# EAGLE design 16x2_lcd_Arduino_Shield (EAGLE 9.6.2)
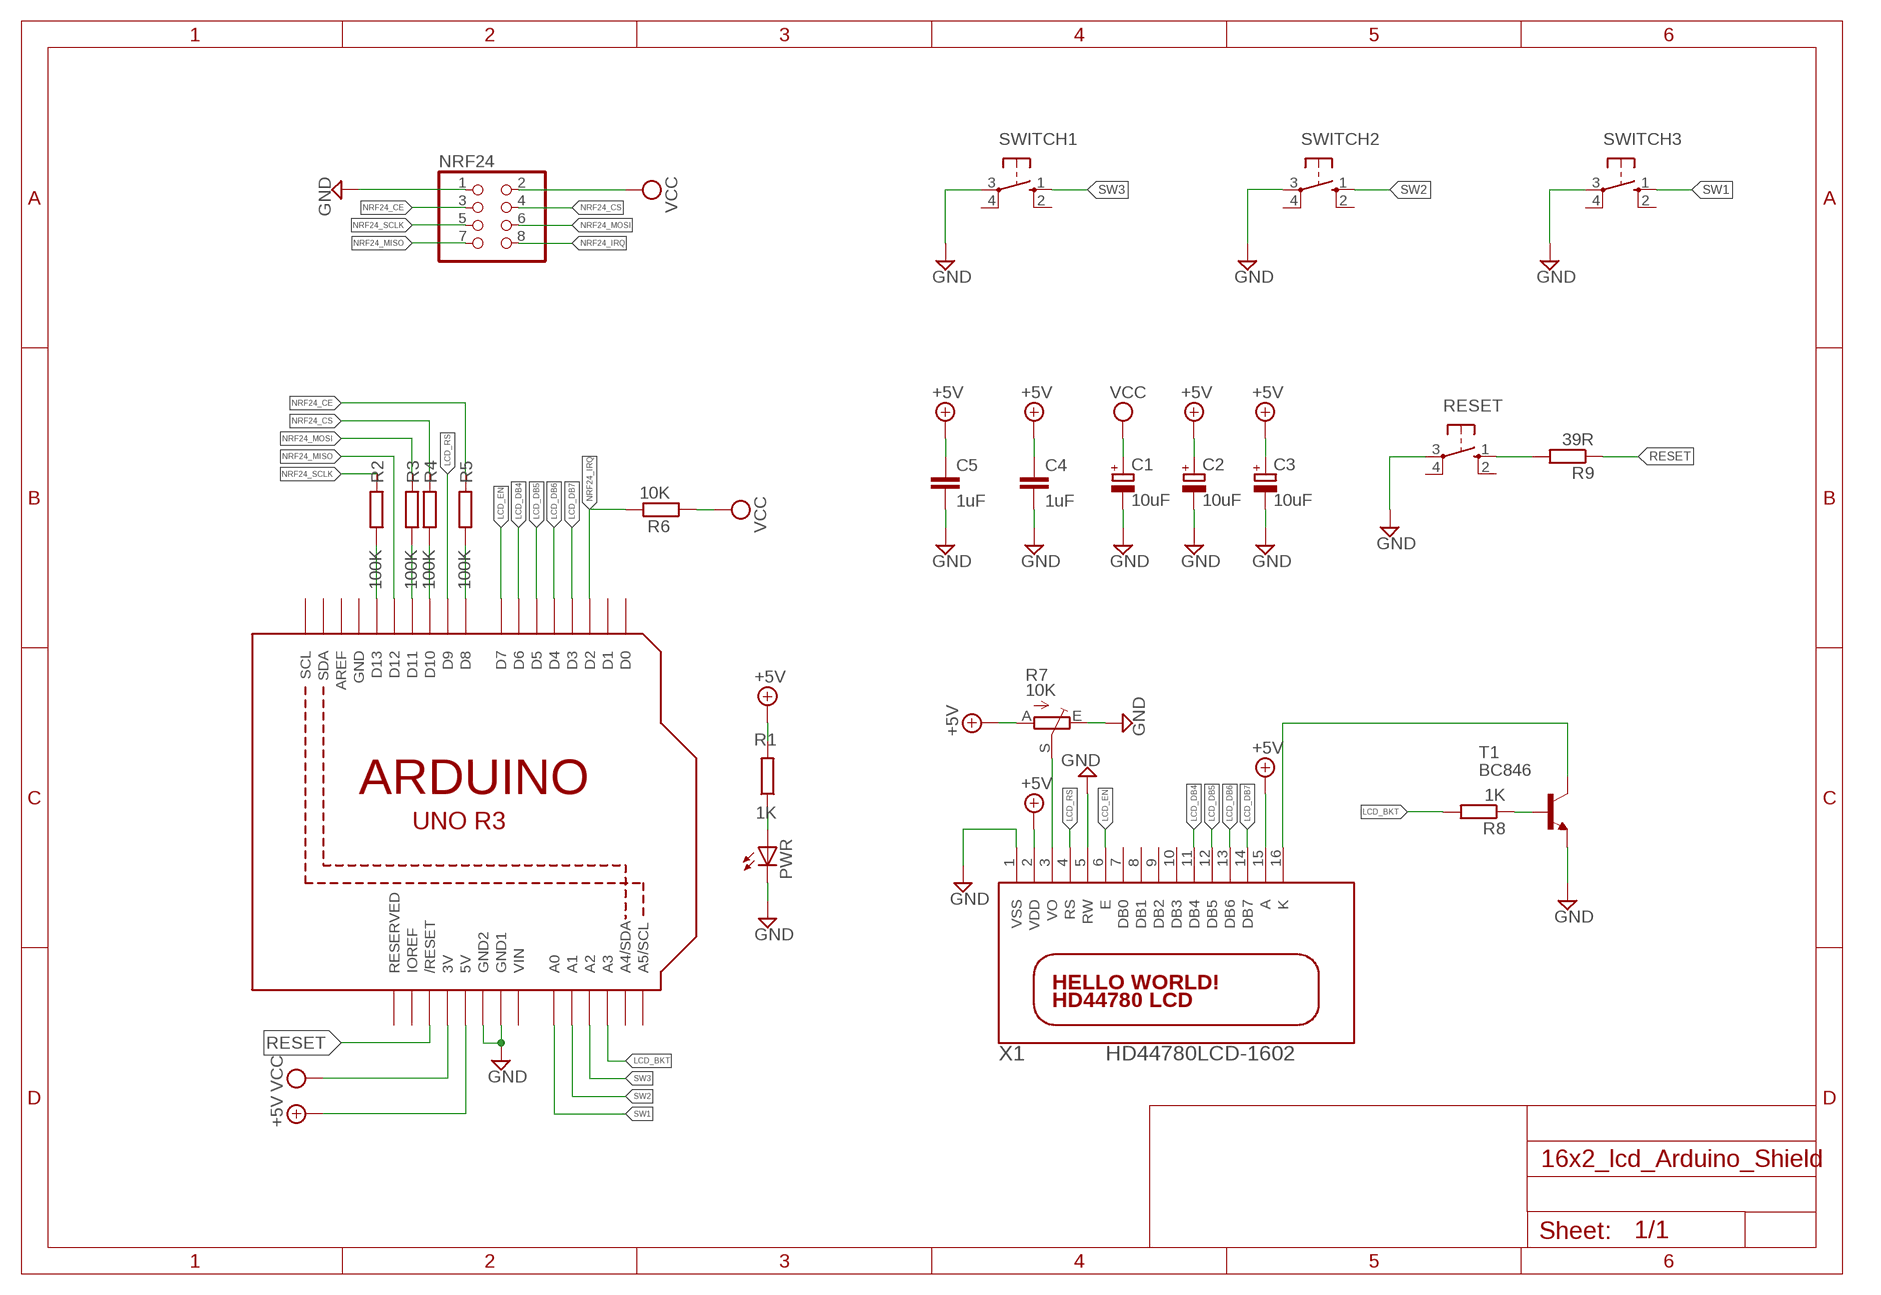
[diagram p0: schematic, sheet 1]

## Parts
C1  10uF  CPOL-EUCT3216  [CT3216]
C2  10uF  CPOL-EUCT3216  [CT3216]
C3  10uF  CPOL-EUCT3216  [CT3216]
C4  1uF  C-EUC1206  [C1206]
C5  1uF  C-EUC1206  [C1206]
NRF24  PINHD-2X4  [2X04]
PWR  LED5MM  [LED5MM]
R1  1K  R-EU_R1206  [R1206]
R2  100K  R-EU_R1206  [R1206]
R3  100K  R-EU_R1206  [R1206]
R4  100K  R-EU_R1206  [R1206]
R5  100K  R-EU_R1206  [R1206]
R6  10K  R-EU_R1206  [R1206]
R7  10K  TRIM_EU-RJ9W  [RJ9W]
R8  1K  R-EU_R1206  [R1206]
R9  39R  R-EU_R1206  [R1206]
RESET  10-XX  [B3F-10XX]
SWITCH1  10-XX  [B3F-10XX]
SWITCH2  10-XX  [B3F-10XX]
SWITCH3  10-XX  [B3F-10XX]
T1  BC846  [SOT23]
U1  ARDUINOR3-BPLACE  [ARDUINOR3-BPLACE]
X1  HD44780LCD-1602  [LCD1602]

## Nets
+5V [POWER]: C2.+ C3.+ C4.1 C5.1 R1.2 R7.A U1.5V X1.2(VDD) X1.15(A)
GND [POWER]: C1.- C2.- C3.- C4.2 C5.2 NRF24.1 PWR.K(C) R7.E RESET.3(P) SWITCH1.3(P) SWITCH2.3(P) SWITCH3.3(P) T1.2(E) U1.GND1 U1.GND2 X1.1(VSS) X1.5(RW)
LCD_BKT [LCD]: R8.2 U1.A3
LCD_DB4 [LCD]: U1.D6 X1.11(DB4)
LCD_DB5 [LCD]: U1.D5 X1.12(DB5)
LCD_DB6 [LCD]: U1.D4 X1.13(DB6)
LCD_DB7 [LCD]: U1.D3 X1.14(DB7)
LCD_EN [LCD]: U1.D7 X1.6(E)
LCD_RS [LCD]: U1.D9 X1.4(RS)
N$1: PWR.A R1.1
N$2: R2.1 U1.D13
N$3: R7.S X1.3(VO)
N$4: R3.1 U1.D11
N$5: R4.1 U1.D10
N$6: T1.3(C) X1.16(K)
N$7: R5.1 U1.D8
N$8: R8.1 T1.1(B)
N$9: R9.2 RESET.1(S)
NRF24_CE [NRF]: NRF24.3 R5.2
NRF24_CS [NRF]: NRF24.4 R4.2
NRF24_IRQ [NRF]: NRF24.8 R6.2 U1.D2
NRF24_MISO [NRF]: NRF24.7 U1.D12
NRF24_MOSI [NRF]: NRF24.6 R3.2
NRF24_SCLK [NRF]: NRF24.5 R2.2
RESET: R9.1 U1.RESET(/RESET)
SW1: SWITCH3.1(S) U1.A0
SW2: SWITCH2.1(S) U1.A1
SW3: SWITCH1.1(S) U1.A2
VCC [POWER]: C1.+ NRF24.2 R6.1 U1.3V
Unconnected: RESET.2(S1) RESET.4(P1) SWITCH1.2(S1) SWITCH1.4(P1) SWITCH2.2(S1) SWITCH2.4(P1) SWITCH3.2(S1) SWITCH3.4(P1) U1.A4(A4/SDA) U1.A5(A5/SCL) U1.AREF U1.D0 U1.D1 U1.IOREF U1.RESERVED U1.SCL U1.SDA X1.7(DB0) X1.8(DB1) X1.9(DB2) X1.10(DB3)

## Power pins joined to a net without a drawn wire
GND: U1.GND
VIN: U1.VIN

## Library data of the parts
C1-C3 = rcl:CPOL-EU: POLARIZED CAPACITOR, European symbol; SPICEPREFIX: C
C4 C5 = rcl:C-EU: CAPACITOR, European symbol; SPICEPREFIX: C
NRF24 = pinhead:PINHD-2X4: PIN HEADER
PWR = adafruit:LED: LED OSRAM: - CHIPLED LG R971, LG N971, LY N971, LG Q971, LY Q971, LO R971, LY R971 LH N974, LH R974 LS Q976, LO Q976, LY Q976 LO Q996 - Hyper CHIPLED LW Q18S LB Q993, LB Q99A, LB R99A - SideLED LS A670, LO A670, LY A670, LG A670, LP A670 LB A673, LV A673, LT A673, LW A673 LH A674 LY A675 LS A676, LA A676, LO A676, LY A676, LW A676 LS A679, LY A679, LG A679 - Hyper Micro SIDELED® LS Y876, LA Y876, LO Y876, LY Y876 LT Y87S - SmartLED LW L88C, LW L88S LB L89C, LB L89S, LG L890 LS L89K, LO L89K, LY L89K LS L896, LA L896, LO L896, LY L896 - TOPLED LS T670, LO T670, LY T670, LG T670, LP T670 LSG T670, LSP T670, LSY T670, LOP T670, LYG T670 LG T671, LOG T671, LSG T671 LB T673, LV T673, LT T673, LW T673 LH T674 LS T676, LA T676, LO T676, LY T676, LB T676, LH T676, LSB T676, LW T676 LB T67C, LV T67C, LT T67C, LS T67K, LO T67K, LY T67K, LW E67C LS E67B, LA E67B, LO E67B, LY E67B, LB E67C, LV E67C, LT E67C LW T67C LS T679, LY T679, LG T679 LS T770, LO T770, LY T770, LG T770, LP T770 LB T773, LV T773, LT T773, LW T773 LH T774 LS E675, LA E675, LY E675, LS T675 LS T776, LA T776, LO T776, LY T776, LB T776 LHGB T686 LT T68C, LB T68C - Hyper Mini TOPLED® LB M676 - Mini TOPLED Santana® LG M470 LS M47K, LO M47K, LY M47K Source: http://www.osram.convergy.de/
R1-R6 R8 R9 = rcl:R-EU_: RESISTOR, European symbol; SPICEPREFIX: R
R7 = pot:TRIM_EU-: POTENTIOMETER
RESET SWITCH1-SWITCH3 = switch-omron:10-XX: OMRON SWITCH; MPN: B3F-1000; OC_FARNELL: 176432; OC_NEWARK: 36M3542
T1 = transistor-neu-to92:BC846: NPN TRANSISTOR
U1 = adafruit:ARDUINOR3: This is a new object for the new Arduino R3 - with extra pins that you may want to use (such as IOref, and duplicated A4/A5
X1 = adafruit:HD44780LCD: HD44780 LCD Standard character type LCDs, available in sizes from 8x1 to 40x4!

## Net classes
0 default: width 0.254 mm, drill 0.406 mm, clearance 0.254 mm
1 POWER: width 0.406 mm, drill 0.406 mm, clearance 0.305 mm
2 NRF: width 0.203 mm, drill 0.406 mm, clearance 0.254 mm
3 LCD: width 0.254 mm, drill 0.406 mm, clearance 0.254 mm

## Board
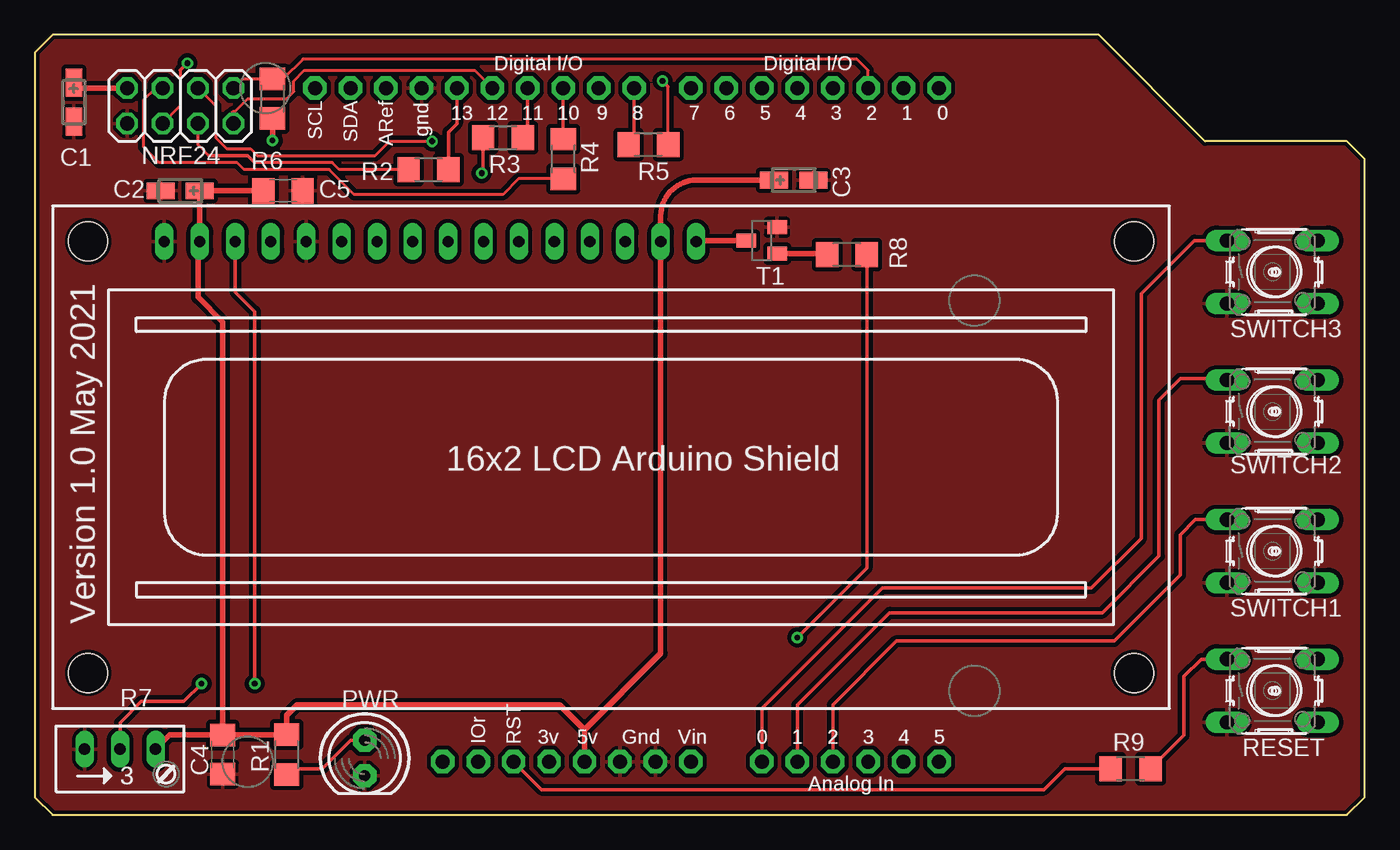
[diagram p1: board, top side]
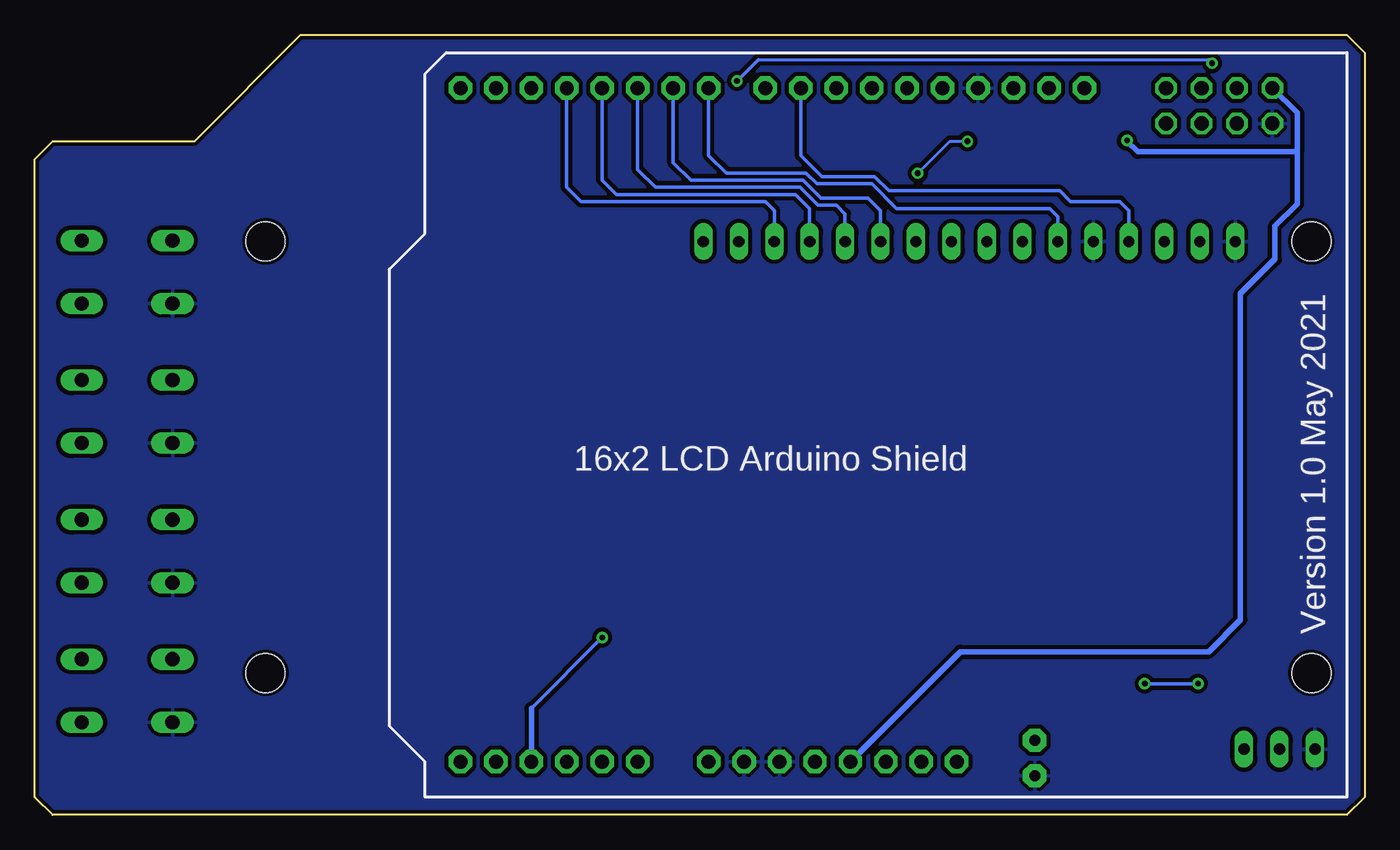
[diagram p2: board, bottom side, seen from below]

Size 95.25 x 55.88 mm. Coordinates in mm from the lower left corner, seen from the top.
Outline: 0,54.61 0,1.27 1.27,0 93.98,0 95.25,1.27 95.25,46.99 93.98,48.26 83.82,48.26 76.2,55.88 1.27,55.88 0,54.61
Copper layers (1*16): Top 0.035mm / dielectric 1.5mm / Bottom 0.035mm
Design rules "default *": minimum track width 6mil, minimum drill 0.35mm, track to track 8mil, track to pad 8mil, pad to pad 8mil, via to via 8mil, smd to smd 8mil, copper to edge 8mil, drill to drill 6mil, minimum pad ring 10mil, minimum via ring 8mil, stop-mask expansion 4mil, vias tented up to drill 0mil, thermal gap 10mil

### Footprints (pad centres in the part's own frame; a part is rotated, then mirrored left to right if it is on the bottom)
CT3216 = smd 2 x 1.2: + -1.4,0; - 1.4,0
C1206 = smd 1.6 x 1.8: 1 -1.4,0; 2 1.4,0
2X04 = drill 1.016 octagon: 1 -3.81,-1.27; 2 -3.81,1.27; 3 -1.27,-1.27; 4 -1.27,1.27; 5 1.27,-1.27; 6 1.27,1.27; 7 3.81,-1.27; 8 3.81,1.27
LED5MM = drill 0.813 pad 1.676 octagon: A -1.27,0; K 1.27,0
R1206 = smd 1.6 x 1.803: 1 -1.422,0; 2 1.422,0
RJ9W = drill 0.813 long: A 2.54,0.635; E -2.54,0.635; S 0,0.635
B3F-10XX = drill 1.016 long: 1 -3.251,2.261; 2 3.251,2.261; 3 -3.251,-2.261; 4 3.251,-2.261
SOT23 = smd 1 x 1.4: 1 -0.95,-1.1; 2 0.95,-1.1; 3 0,1.1
ARDUINOR3-BPLACE = drill 1 pad 1.676 octagon: 3V 35.56,2.54; 5V 38.1,2.54; A0 50.8,2.54; A1 53.34,2.54; A2 55.88,2.54; A3 58.42,2.54; A4 60.96,2.54; A5 63.5,2.54; AREF 23.876,50.8; D0 63.5,50.8; D1 60.96,50.8; D2 58.42,50.8; D3 55.88,50.8; D4 53.34,50.8; D5 50.8,50.8; D6 48.26,50.8; D7 45.72,50.8; D8 41.656,50.8; D9 39.116,50.8; D10 36.576,50.8; D11 34.036,50.8; D12 31.496,50.8; D13 28.956,50.8; GND 26.416,50.8; GND1 43.18,2.54; GND2 40.64,2.54; IOREF 30.48,2.54; RESERVED 27.94,2.54; RESET 33.02,2.54; SCL 18.796,50.8; SDA 21.336,50.8; VIN 45.72,2.54
LCD1602 = drill 0.8 long: 1 8,33.46; 2 10.54,33.46; 3 13.08,33.46; 4 15.62,33.46; 5 18.16,33.46; 6 20.7,33.46; 7 23.24,33.46; 8 25.78,33.46; 9 28.32,33.46; 10 30.86,33.46; 11 33.4,33.46; 12 35.94,33.46; 13 38.48,33.46; 14 41.02,33.46; 15 43.56,33.46; 16 46.1,33.46 | hole 2.8: 2.54,2.54; 2.54,33.46; 77.46,33.46; 77.46,2.54

### Placement (x,y rotation side)
C1  2.79,51.05 270 top
C2  10.41,44.7 180 top
C3  54.36,45.47 0 top
C4  13.46,4.32 270 top
C5  17.78,44.7 0 top
NRF24  10.41,50.8 0 top
PWR  23.62,4.06 270 top
R1  18.03,4.32 90 top
R2  28.19,46.23 180 top
R3  33.53,48.51 180 top
R4  37.85,46.99 270 top
R5  43.94,48.01 0 top
R6  17.02,51.31 90 top
R7  6.1,4.06 0 top
R8  58.17,40.13 0 top
R9  78.49,3.3 0 top
RESET  88.65,8.89 0 top
SWITCH1  88.65,18.89 0 top
SWITCH2  88.65,28.89 0 top
SWITCH3  88.65,38.89 0 top
T1  52.07,41.15 90 top
U1  1.27,1.27 0 top
X1  1.27,7.62 0 top

### Tracks (layer width: path | path; a pad name or v marks a point on that pad's centre or on a via)
+5V
  Top 0.406: 39.37,6.1 44.83,11.56 X1.15 44.83,42.93 arc-90 47.37,45.47 C3.+ | 39.37,6.1 U1.5V | 39.37,6.1 37.59,7.87 18.8,7.87 18.03,7.11 R1.2 13.48,5.74 C4.1 | R7.A 9.66,5.72 C4.1 | C5.1 C2.+ X1.2 11.68,40.95 11.68,37.08 13.46,35.31 13.46,5.59 C4.1
GND
  pour Top (isolate 0.254): 0.25,54.36 1.44,56.13 75.69,56.13 83.57,48.26 93.98,48.26 95,47.24 95.25,47.24 95.25,1.27 94.23,0.25 1.27,0.25 0,1.52 0,54.1
  pour Bottom (isolate 0.254): 0.25,1.27 0.25,55.12 1.27,56.13 75.95,56.13 83.82,48.26 93.98,48.26 95.25,46.99 95.25,1.52 93.98,0.25 1.27,0.25
LCD_BKT  (via drill 0.41)
  Top 0.254: R8.2 59.59,17.68 v54.61,12.7
  Bottom 0.254: v54.61,12.7 59.69,7.62
  Bottom 0.406: 59.69,7.62 U1.A3
LCD_DB4
  Bottom 0.254: X1.11 34.67,43.31 35.56,44.2 38.95,44.2 40.22,45.47 48.26,45.47 49.53,46.74 U1.D6
LCD_DB5
  Bottom 0.254: X1.12 37.21,43.05 37.85,43.69 39.16,43.69 40.43,44.96 50.8,44.96 52.07,46.23 U1.D5
LCD_DB6
  Bottom 0.254: U1.D4 54.61,45.47 53.59,44.45 40.77,44.45 39.75,43.43 X1.13
LCD_DB7
  Bottom 0.254: X1.14 42.29,43.31 42.93,43.94 56.13,43.94 57.15,44.96 U1.D3
LCD_EN
  Bottom 0.254: X1.6 21.97,42.86 22.55,43.43 33.53,43.43 35.31,45.21 39.25,45.21 40.01,45.97 45.72,45.97 46.99,47.24 U1.D7
LCD_RS
  Bottom 0.254: X1.4 16.89,43.31 17.53,43.94 21.08,43.94 21.84,44.7 34.08,44.7 35.1,45.72 38.86,45.72 40.39,47.24 U1.D9
N$1
  Top 0.254: 18.44,3.3 20.57,3.3 22.61,5.33 PWR.A
  Top 0.406: R1.1 18.44,3.3
N$2
  Top 0.254: U1.D13 30.23,49.53 29.62,48.92 R2.1
N$3  (via drill 0.41)
  Top 0.254: X1.3 14.35,37.47 15.75,36.07 v15.75,9.4 | v11.94,9.4 10.67,8.13 7.62,8.13 6.1,6.6 R7.S
  Bottom 0.254: v15.75,9.4 v11.94,9.4
N$4
  Top 0.254: U1.D11 35.31,48.87 R3.1
N$5
  Top 0.254: U1.D10 R4.1
N$6
  Top 0.406: X1.16 47.44,41.15 T1.3
N$7
  Top 0.254: U1.D8 42.93,48.41 R5.1
N$8
  Top 0.406: T1.1 56.68,40.2 R8.1
N$9
  Top 0.254: R9.2 82.3,5.69 82.3,9.91 83.54,11.15 RESET.1
NRF24_CE  (via drill 0.41)
  Top 0.203: R5.2 45.36,52.17 | 10.41,53.34 10.41,50.8 NRF24.3
  Top 0.254: 45.36,52.17 v44.96,52.58 | v10.92,53.85 10.41,53.34
  Bottom 0.203: 43.43,54.1 11.18,54.1 v10.92,53.85
  Bottom 0.254: v44.96,52.58 43.43,54.1
NRF24_CS
  Top 0.203: R4.2 34.65,45.57 33.53,44.45 22.86,44.45 21.08,46.23 14.99,46.23 14.48,46.74 8.89,46.74 7.8,47.83 7.8,51.23 8.64,52.07
  Top 0.254: 8.64,52.07 NRF24.4
NRF24_IRQ
  Top 0.203: U1.D2 59.69,53.34 58.88,54.15 19.2,54.15 17.78,52.73 R6.2 14.88,52.73 NRF24.8
NRF24_MISO
  Top 0.203: U1.D12 31.5,53.34 19.3,53.34 18.54,52.58 18.54,51.82 18.03,51.31 15.24,51.31 14.22,50.29
  Top 0.406: NRF24.7 14.22,50.29
NRF24_MOSI  (via drill 0.41)
  Top 0.203: v28.45,48.26 25.4,48.26 24.38,47.24 15.92,47.24 15.44,47.73 13.74,47.73 12.95,48.51 12.95,50.8 NRF24.6
  Top 0.254: R3.2 32.11,46.08 v32,45.97
  Bottom 0.203: v32,45.97 29.72,48.26 v28.45,48.26
NRF24_SCLK
  Top 0.203: R2.2 21.8,46.23 21.29,46.74 15.75,46.74 | 12.45,47.24 11.68,48.01 NRF24.5
  Top 0.254: 12.45,47.24 15.24,47.24 15.75,46.74
RESET
  Top 0.254: U1.RESET 36.3,1.8 72.26,1.8 73.76,3.3 R9.1
SW1
  Top 0.254: U1.A0 52.07,7.62 60.71,16.26 75.69,16.26 79.25,19.81 79.25,37.34 83.06,41.15 SWITCH3.1
SW2
  Top 0.254: U1.A1 54.61,7.87 61.21,14.48 76.45,14.48 80.52,18.54 80.52,29.72 82.04,31.24 85.56,31.24
  Top 0.406: 85.56,31.24 SWITCH2.1
SW3
  Top 0.254: U1.A2 57.15,7.87 61.72,12.45 77.31,12.45 82.04,17.18 82.04,20.07 83.13,21.15 SWITCH1.1
VCC  (via drill 0.41)
  Top 0.406: NRF24.2 3.18,52.07 C1.+ | R6.1 v17.02,48.31
  Bottom 0.406: NRF24.2 4.83,50.29 4.83,47.5 | U1.3V 28.96,11.68 11.18,11.68 8.89,13.97 8.89,37.34 6.43,39.8 6.43,42.16 4.83,43.77 4.83,47.5 | v17.02,48.31 17.02,48.26 16.26,47.5 4.83,47.5

### Text on the board
tNames: Version 1.0 May 2021 | 16x2 LCD Arduino Shield
bNames: 16x2 LCD Arduino Shield | Version 1.0 May 2021
_tplace: Digital I/O | Digital I/O | SCL | SDA | ARef | gnd | 13 | 12 | 11 | 10 | 9 | 8 | 7 | 6 | 5 | 4 | 3 | 2 | 1 | 0 | IOr | RST | 3v | 5v | Gnd | Vin | 0 | 1 | 2 | 3 | 4 | 5 | 3 | Analog In